# Altium schematic sheet hall_sensor.SchDoc
size 209 x 297 mm; Address1: Address1; Address2: Address2; Address3: Address3; Address4: Address4; SheetNumber: 1; Scale: 1:1; Разраб.: Иванов; Обозначение документа: АБВГ.123456.001 Э3; Пров.: Петров; Утв.: Сидоров; Наименование организации: ОАО "Концерн "МПО-Гидроприбор"; Перв. применение: АБВГ.123456.000; Наименование изделия 1: Плата; Наименование изделия 2: Схема электрическая; Наименование изделия 3: принципиальная; Нач. отд.: Нач. отд.; Фамилия нач. отд.: Сидоров
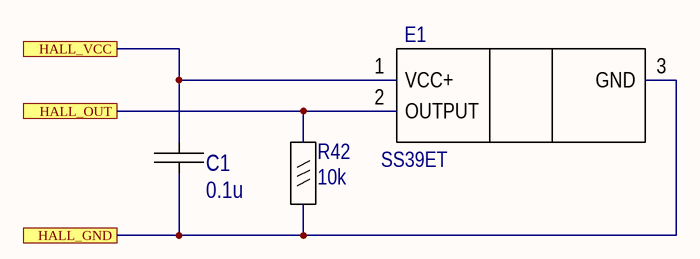
[diagram p0: hall_sensor.SchDoc]

## Parts
C1  0.1u  [C0603_IPC]
E1  SS39ET  [SOT-23]
R42  10k  [R0603]

## Ports
HALL_GND, HALL_OUT, HALL_VCC

## Nets
HALL_GND: C1.2 E1.3(GND) R42.1 ; port HALL_GND
HALL_OUT: E1.2(OUTPUT) R42.2 ; port HALL_OUT
HALL_VCC: C1.1 E1.1(VCC+) ; port HALL_VCC

## Notes on the sheet
- Перв. примен.
- Справ. №
- Подп. и дата
- Инв. № дубл.
- Взам. инв. №
- Разраб.
- Изм.
- Лист
- № докум.
- Подп.
- Дата
- Лит.
- Масса
- Масштаб
- Пров.
- Т.контр.
- Листов
- Инв. № подл.
- Утв.
- Н.контр.
- Копировал
- Формат А4

## Library data of the parts
C1 = 0.1u 50V: 0.1uF ±10% 50V Ceramic Capacitor X7R 0603 (1608 Metric); MPN: CL10B104KB8NNND; Manufacturer: Samsung; Tolerance: 0,1; PartNumber: 0.1u 50V; Value: 0.1u; Voltage/Power: 50V; LibraryPath: _library\sch\cap.schlib; FootprintPath: _library\pcb\capSmd.pcblib; ComponentLink2URL: https://www.digikey.com/product-detail/en/yageo/CC0603KRX7R9BB104/311-1344-2-ND/2103082; ComponentLink2Description: site; Type: X7R; price elitan 1000pc: 0.63; price terra 1000pc: 0.65
E1 = SS39ET: Hall Effect Sensor Single Axis SOT-23; Name: SS39ET; MPN: SS39ET; ComponentLink1URL: D:\_library\pdf\transistors\STD12NF06LT4.pdf; ComponentLink1Description: datasheet; ComponentLink2URL: https://www.digikey.com/product-detail/en/honeywell-sensing-and-productivity-solutions/SS39ET/480-3845-2-ND/2839676; ComponentLink2Description: site; ComponentLink3URL: STD20NF06
R42 = 10k 5%: 10 kOhms ±5% 0.1W, 1/10W Chip Resistor 0603 (1608 Metric) Moisture Resistant Thick Film; MPN: RC0603JR-0710kL; Manufacturer: yageo; Name: 10k 5%; Voltage/Power: 0.063; Value: 10k; Tolerance: 5%; ComponentLink2URL: https://www.digikey.com/product-detail/en/yageo/RC0603JR-0710KL/311-10KGRTR-ND/726700; ComponentLink2Description: site; price elitan 1000pc: 0.17; price terra 1000pc: 0.15; LibraryPath: sch\res.schlib; FootprintPath: pcb\resSmd.pcblib